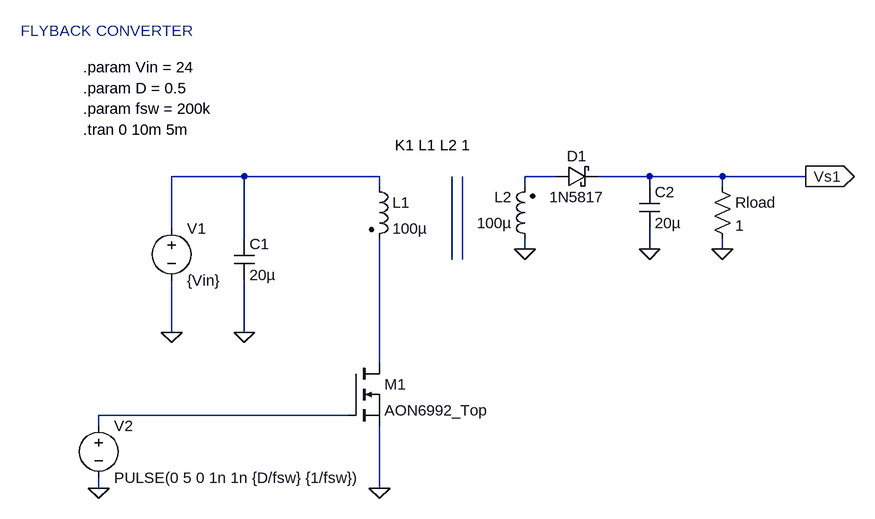
[diagram p0: schematic flyback.asc]
flyback.asc, the LTspice schematic file:
Version 4
SHEET 1 1160 896
WIRE 208 240 96 240
WIRE 416 240 208 240
WIRE 688 240 640 240
WIRE 832 240 752 240
WIRE 944 240 832 240
WIRE 1072 240 944 240
WIRE 416 256 416 240
WIRE 640 256 640 240
WIRE 832 256 832 240
WIRE 944 256 944 240
WIRE 96 320 96 240
WIRE 208 336 208 240
WIRE 640 352 640 336
WIRE 832 352 832 320
WIRE 944 352 944 336
WIRE 528 368 528 240
WIRE 544 368 544 240
WIRE 96 480 96 400
WIRE 208 480 208 400
WIRE 416 528 416 336
WIRE 368 608 -16 608
WIRE -16 624 -16 608
WIRE -16 720 -16 704
WIRE 416 720 416 624
FLAG 416 720 0
FLAG 96 480 0
FLAG 640 352 0
FLAG 944 352 0
FLAG 208 480 0
FLAG -16 720 0
FLAG 832 352 0
FLAG 1072 240 Vs1
IOPIN 1072 240 Out
SYMBOL ind2 400 240 R0
SYMATTR InstName L1
SYMATTR Type ind
SYMATTR Value 100µ
SYMBOL voltage 96 304 R0
SYMATTR InstName V1
SYMATTR Value {Vin}
SYMBOL Res 928 240 R0
SYMATTR InstName Rload
SYMATTR Value 1
SYMBOL schottky 688 256 R270
WINDOW 0 32 32 VTop 2
WINDOW 3 0 32 VBottom 2
SYMATTR InstName D1
SYMATTR Value 1N5817
SYMATTR Description Diode
SYMATTR Type diode
SYMBOL nmos 368 528 R0
SYMATTR InstName M1
SYMATTR Value AON6992_Top
SYMBOL ind2 656 352 R180
WINDOW 0 36 80 Left 2
WINDOW 3 36 40 Left 2
SYMATTR InstName L2
SYMATTR Value 100µ
SYMATTR Type ind
SYMBOL Cap 192 336 R0
SYMATTR InstName C1
SYMATTR Value 20µ
SYMBOL Voltage -16 608 R0
SYMATTR InstName V2
SYMATTR Value PULSE(0 5 0 1n 1n {D/fsw} {1/fsw})
SYMBOL Cap 816 256 R0
SYMATTR InstName C2
SYMATTR Value 20µ
TEXT -40 168 Left 2 !.tran 0 10m 5m
TEXT 440 192 Left 2 !K1 L1 L2 1
TEXT -136 16 Left 2 ;FLYBACK CONVERTER
TEXT -40 72 Left 2 !.param Vin = 24
TEXT -40 104 Left 2 !.param D = 0.5
TEXT -40 136 Left 2 !.param fsw = 200k

The netlist it stands for:
* flyback.asc
L1 N001 N005 100µ
V1 N001 0 {Vin}
Rload Vs1 0 1
D1 N002 Vs1 1N5817
M1 N005 N006 0 0 AON6992_Top
L2 0 N002 100µ
C1 N001 0 20µ
V2 N006 0 PULSE(0 5 0 1n 1n {D/fsw} {1/fsw})
C2 Vs1 0 20µ
.model D D
.lib standard.dio
.model NMOS NMOS
.model PMOS PMOS
.lib standard.mos
.tran 0 10m 5m
K1 L1 L2 1
* FLYBACK CONVERTER
.param Vin = 24
.param D = 0.5
.param fsw = 200k
.backanno
.end